# EAGLE design new 11 new (EAGLE 7.6.0)
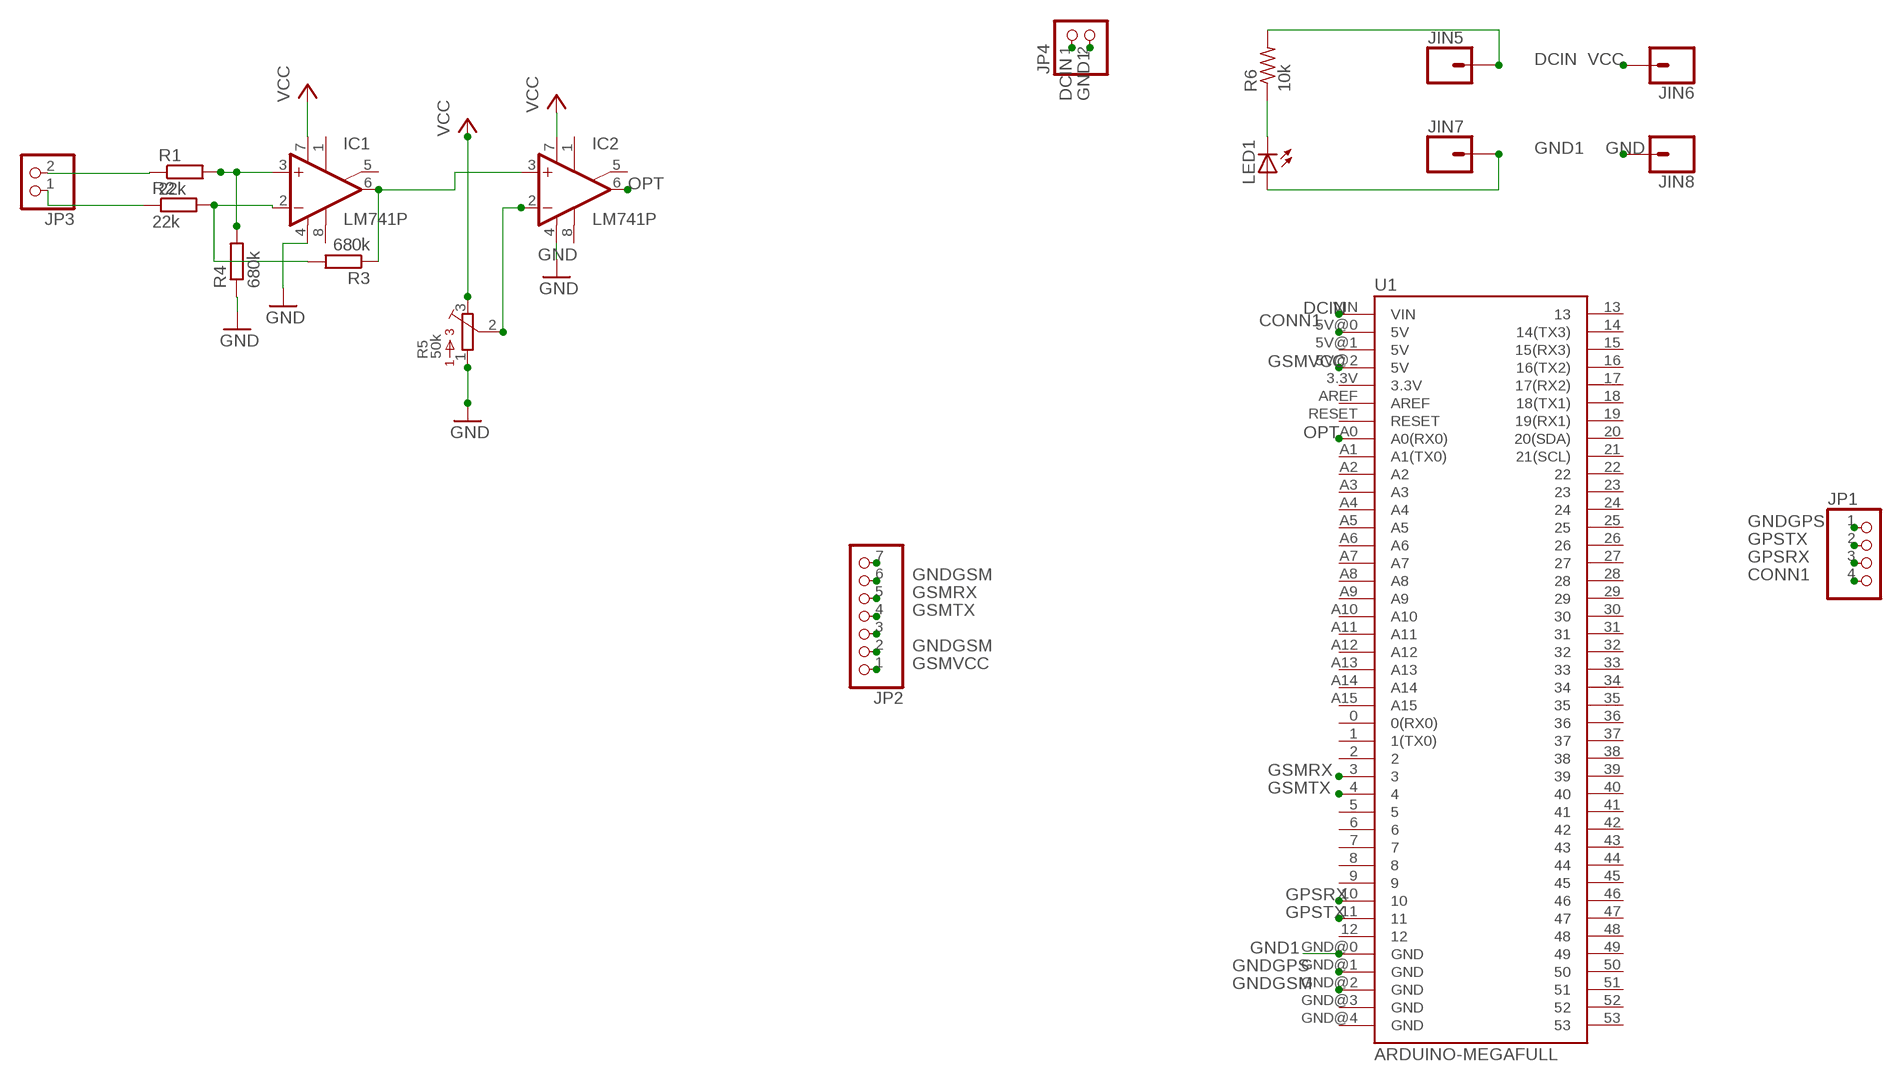
[diagram p0: schematic, sheet 1]

## Parts
IC1  LM741P  [DIL08]
IC2  LM741P  [DIL08]
JIN5  CONN_01  [1X01]
JIN6  CONN_01  [1X01]
JIN7  CONN_01  [1X01]
JIN8  CONN_01  [1X01]
JP1  PINHD-1X4  [1X04]
JP2  PINHD-1X7  [1X07]
JP3  PINHD-1X2  [1X02]
JP4  PINHD-1X2  [1X02]
LED1  LEDSQR2X5  [LED2X5]
R1  22k  R-EU_0204/7  [0204/7]
R2  22k  R-EU_0204/7  [0204/7]
R3  680k  R-EU_0204/7  [0204/7]
R4  680k  R-EU_0204/7  [0204/7]
R5  50k  3362H  [3362H]
R6  10k  R-US_0204/5  [0204/5]
U1  ARDUINO-MEGAFULL  [ARDUINO_MEGA]

## Nets
CONN1: JP1.4 U1.5V@0(5V)
DCIN: JIN5.1 JP4.1 R6.2 U1.VIN
GND: IC1.4(V-) IC2.4(V-) JIN8.1 R4.1 R5.1
GND1: JIN7.1 JP4.2 LED1.A U1.GND@0(GND)
GNDGPS: JP1.1 U1.GND@1(GND)
GNDGSM: JP2.2 JP2.6 U1.GND@2(GND)
GPSRX: JP1.3 U1.10
GPSTX: JP1.2 U1.11
GSMRX: JP2.5 U1.3
GSMTX: JP2.4 U1.4
GSMVCC: JP2.1 U1.5V@2(5V)
N$1: IC1.6(OUT) IC2.3(+IN) R3.1
N$2: IC1.2(-IN) R2.2 R3.2
N$3: JP3.1 R2.1
N$4: LED1.K(C) R6.1
N$5: JP3.2 R1.1
N$8: JP2.3
N$9: IC2.2(-IN) R5.2
N$11: IC1.3(+IN) R1.2 R4.2
N$13: JP2.7
OPT: IC2.6(OUT) U1.A0(A0(RX0))
VCC: IC1.7(V+) IC2.7(V+) JIN6.1 R5.3
Unconnected: IC1.1(ON1) IC1.5(ON2) IC1.8(OPT) IC2.1(ON1) IC2.5(ON2) IC2.8(OPT) U1.0(0(RX0)) U1.1(1(TX0)) U1.2 U1.3.3V U1.5 U1.5V@1(5V) U1.6 U1.7 U1.8 U1.9 U1.12 U1.13 U1.14(14(TX3)) U1.15(15(RX3)) U1.16(16(TX2)) U1.17(17(RX2)) U1.18(18(TX1)) U1.19(19(RX1)) U1.20(20(SDA)) U1.21(21(SCL)) U1.22 U1.23 U1.24 U1.25 U1.26 U1.27 U1.28 U1.29 U1.30 U1.31 U1.32 U1.33 U1.34 U1.35 U1.36 U1.37 U1.38 U1.39 U1.40 U1.41 U1.42 U1.43 U1.44 U1.45 U1.46 U1.47 U1.48 U1.49 U1.50 U1.51 U1.52 U1.53 U1.A1(A1(TX0)) U1.A2 U1.A3 U1.A4 U1.A5 U1.A6 U1.A7 U1.A8 U1.A9 U1.A10 U1.A11 U1.A12 U1.A13 U1.A14 U1.A15 U1.AREF U1.GND@3(GND) U1.GND@4(GND) U1.RESET

## Library data of the parts
IC1 IC2 = linear:*741: OP AMP
JIN5-JIN8 = SparkFun-Connectors:CONN_01: Single connection point. Often used as Generic Header-pin footprint for 0.1 inch spaced/style header connections On any of the 0.1 inch spaced packages, you can populate with these: Break Away Headers - Straight <https://www.sparkfun.com/products/116> (PRT-00116) Break Away Male Headers - Right Angle <https://www.sparkfun.com/products/553> (PRT-00553) Female Headers <https://www.sparkfun.com/products/115> (PRT-00115) Break Away Headers - Machine Pin <https://www.sparkfun.com/products/117> (PRT-00117) Break Away Female Headers - Swiss Machine Pin <https://www.sparkfun.com/products/743> (PRT-00743) This device is also useful as a general connection point to wire up your design to another part of your project. Our various solder wires solder well into these plated through hole pads. Hook-Up Wire - Assortment (Stranded, 22 AWG) <https://www.sparkfun.com/products/11375> (PRT-11375) Hook-Up Wire - Assortment (Solid Core, 22 AWG) <https://www.sparkfun.com/products/11367> (PRT-11367) View the entire wire category on our website here <https://www.sparkfun.com/categories/141> Special notes: SMTSO-256-ET is a "flush mount" nut for a 4-40 screw. We mostly use this on specialty testbeds; it is a nice way to connect hardware to your PCB at an adjustable hieght. Also note, the SNAP packages are for using a snappable style connector. We sell a baggie of snaps and they are also used on two LilyPad designs: Snap Assortment - 30 pack (male and female) <https://www.sparkfun.com/products/11347> (DEV-11347) LilyPad Arduino SimpleSnap <https://www.sparkfun.com/products/10941> (DEV-10941) LilyPad SimpleSnap Protoboard <https://www.sparkfun.com/products/10940> (DEV-10940)
JP1 = pinhead:PINHD-1X4: PIN HEADER
JP2 = pinhead:PINHD-1X7: PIN HEADER
JP3 JP4 = pinhead:PINHD-1X2: PIN HEADER
LED1 = adafruit:LED: LED OSRAM: - CHIPLED LG R971, LG N971, LY N971, LG Q971, LY Q971, LO R971, LY R971 LH N974, LH R974 LS Q976, LO Q976, LY Q976 LO Q996 - Hyper CHIPLED LW Q18S LB Q993, LB Q99A, LB R99A - SideLED LS A670, LO A670, LY A670, LG A670, LP A670 LB A673, LV A673, LT A673, LW A673 LH A674 LY A675 LS A676, LA A676, LO A676, LY A676, LW A676 LS A679, LY A679, LG A679 - Hyper Micro SIDELED® LS Y876, LA Y876, LO Y876, LY Y876 LT Y87S - SmartLED LW L88C, LW L88S LB L89C, LB L89S, LG L890 LS L89K, LO L89K, LY L89K LS L896, LA L896, LO L896, LY L896 - TOPLED LS T670, LO T670, LY T670, LG T670, LP T670 LSG T670, LSP T670, LSY T670, LOP T670, LYG T670 LG T671, LOG T671, LSG T671 LB T673, LV T673, LT T673, LW T673 LH T674 LS T676, LA T676, LO T676, LY T676, LB T676, LH T676, LSB T676, LW T676 LB T67C, LV T67C, LT T67C, LS T67K, LO T67K, LY T67K, LW E67C LS E67B, LA E67B, LO E67B, LY E67B, LB E67C, LV E67C, LT E67C LW T67C LS T679, LY T679, LG T679 LS T770, LO T770, LY T770, LG T770, LP T770 LB T773, LV T773, LT T773, LW T773 LH T774 LS E675, LA E675, LY E675, LS T675 LS T776, LA T776, LO T776, LY T776, LB T776 LHGB T686 LT T68C, LB T68C - Hyper Mini TOPLED® LB M676 - Mini TOPLED Santana® LG M470 LS M47K, LO M47K, LY M47K Source: http://www.osram.convergy.de/
R1-R4 = rcl:R-EU_: RESISTOR, European symbol; SPICEPREFIX: R
R5 = bourns:3362: 3362 Series 1/4" Square Trimmer
R6 = adafruit:R-US_: RESISTOR, American symbol
U1 = SparkFun-Boards:ARDUINO-MEGA: Arduino Mega board footprint

## Net classes
0 default: width 0.305 mm, drill 0.508 mm, clearance 0.254 mm

## Board
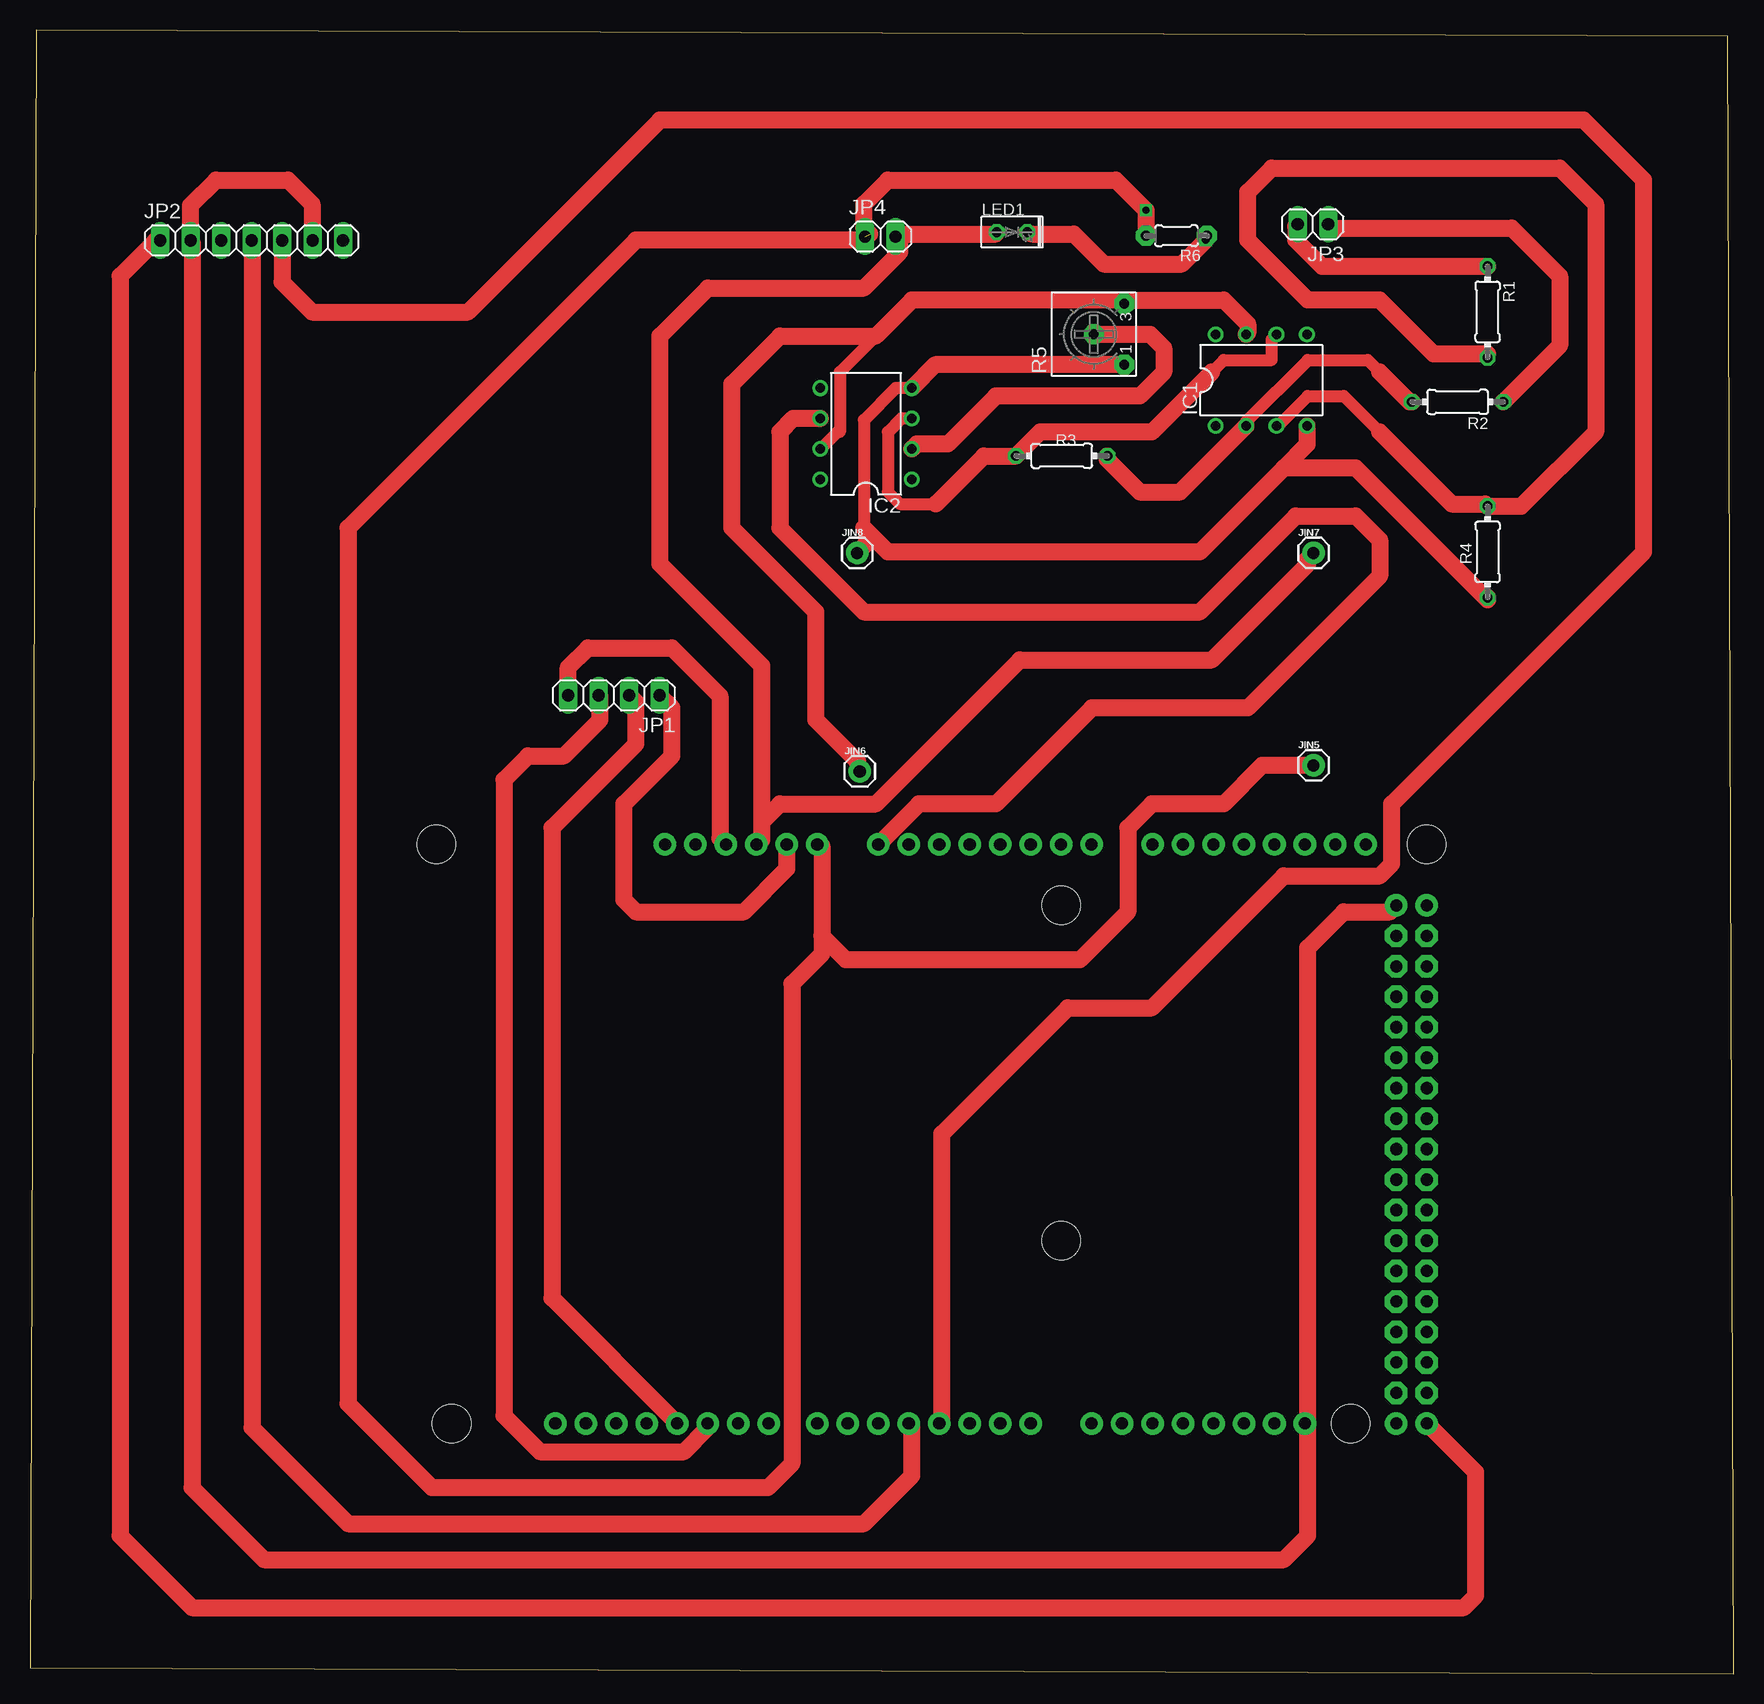
[diagram p1: board, top side]
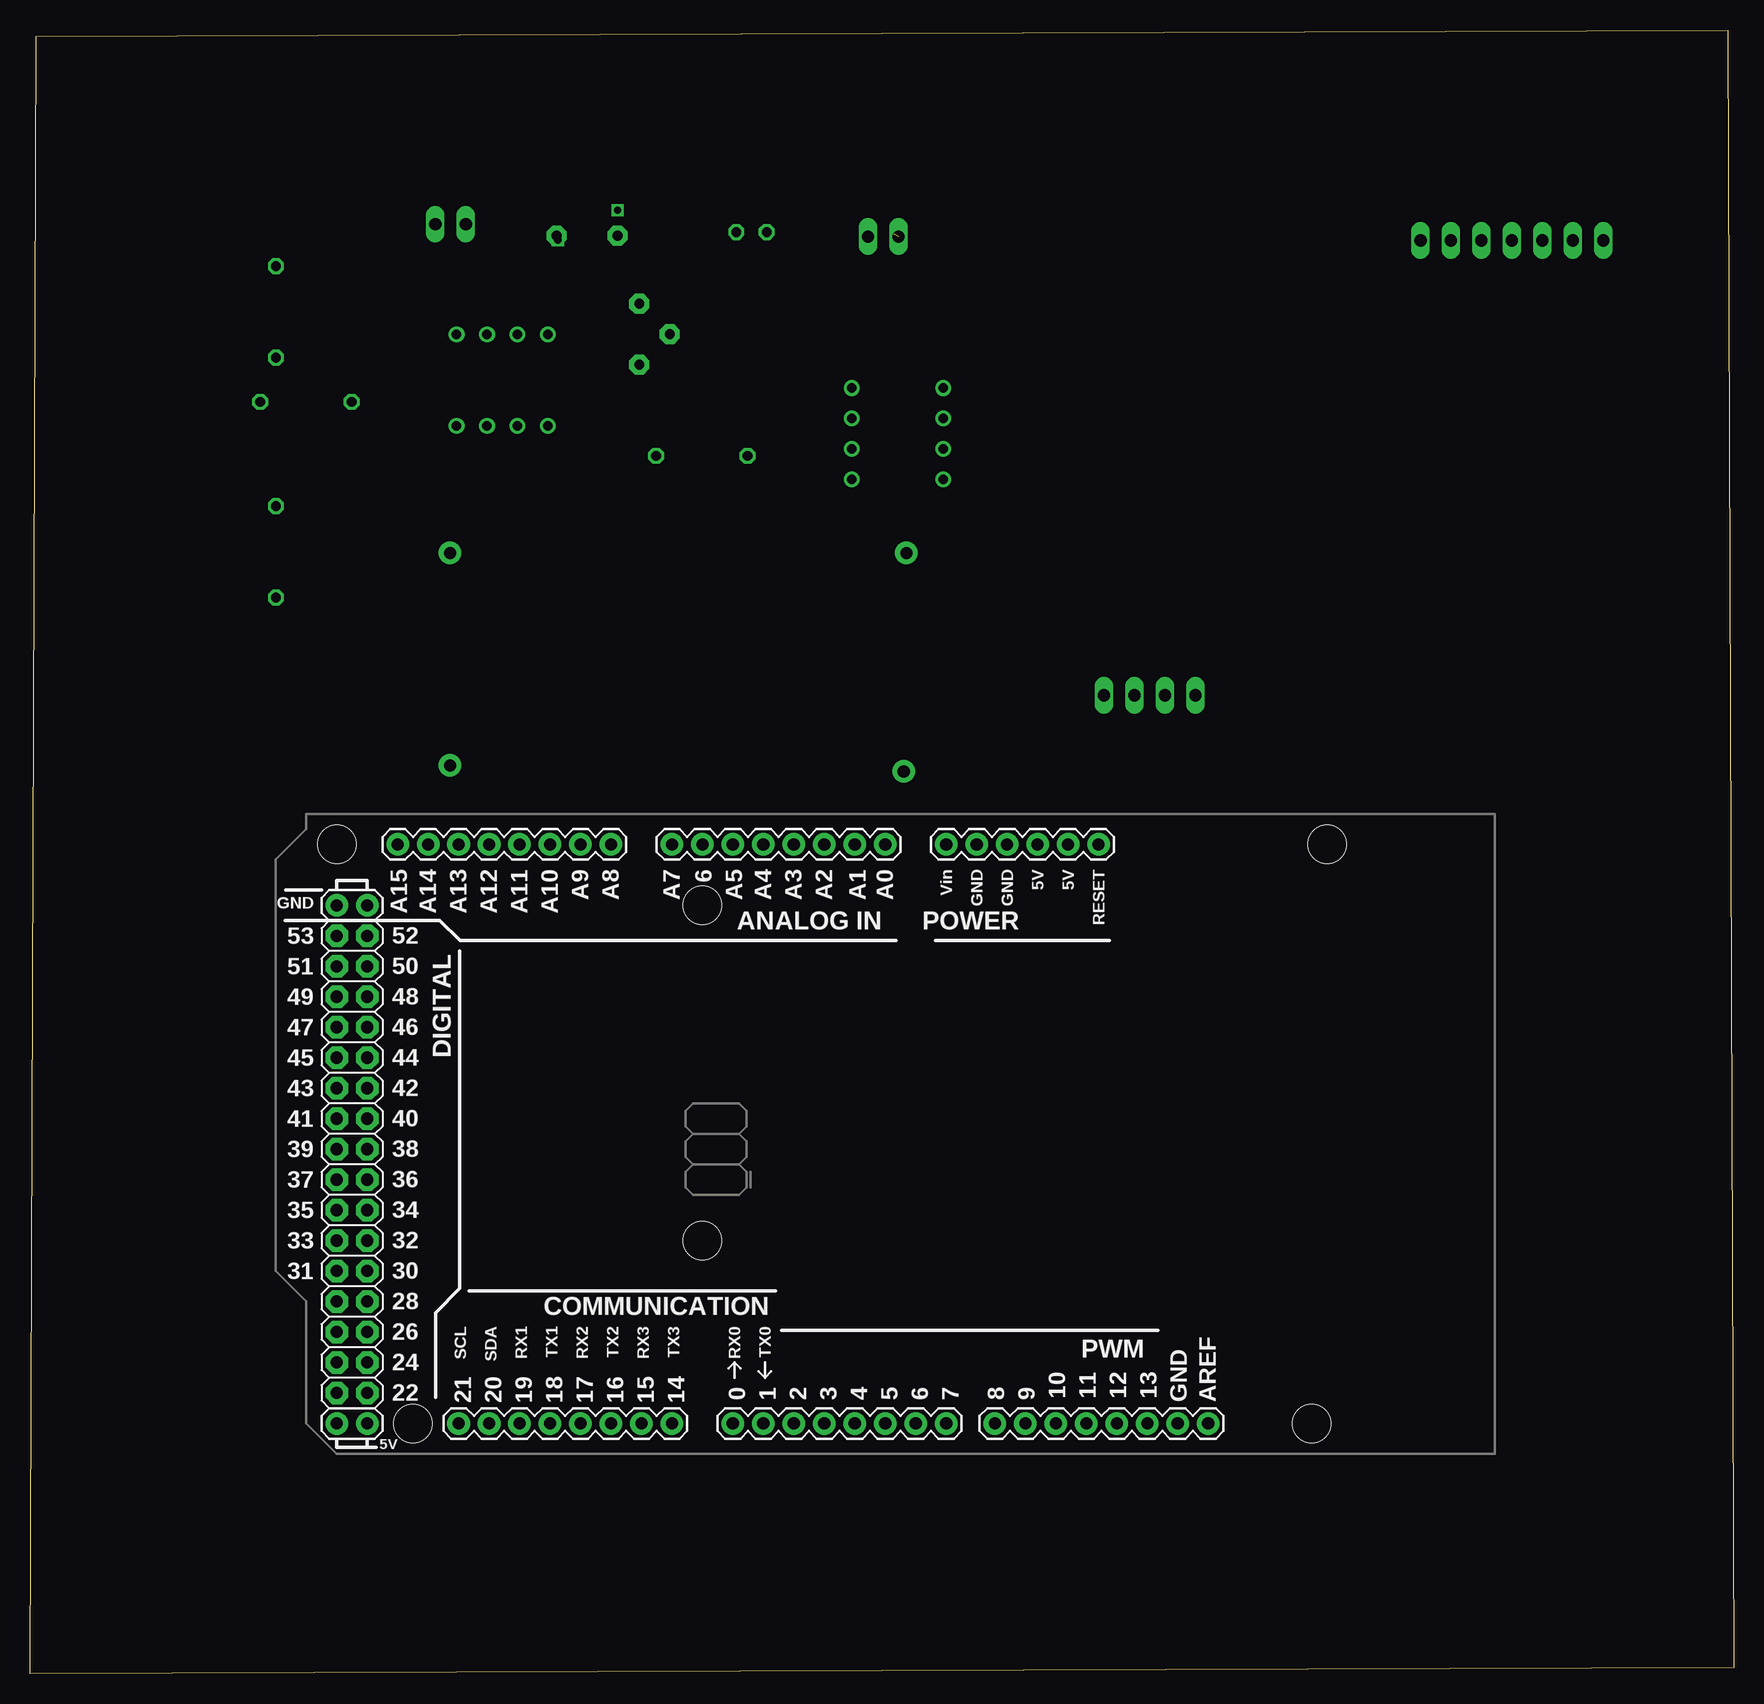
[diagram p2: board, bottom side, seen from below]

Size 142 x 137 mm. Coordinates in mm from the lower left corner, seen from the top.
Outline: 0,0.5 142,0 141.5,136.5 0.5,137 0,0.5
Copper layers (1*16): Top 0.035mm / dielectric 1.5mm / Bottom 0.035mm
Design rules "default *": minimum track width 0.7mm, minimum drill 24mil, track to track 0.7mm, track to pad 8mil, pad to pad 8mil, via to via 8mil, smd to smd 8mil, copper to edge 40mil, drill to drill 8mil, minimum pad ring 10mil, minimum via ring 8mil, stop-mask expansion 4mil, vias tented up to drill 0mil, thermal gap 10mil

### Footprints (pad centres in the part's own frame; a part is rotated, then mirrored left to right if it is on the bottom)
DIL08 = drill 0.813 pad 1.27: 1 -3.81,-3.81; 2 -1.27,-3.81; 3 1.27,-3.81; 4 3.81,-3.81; 5 3.81,3.81; 6 1.27,3.81; 7 -1.27,3.81; 8 -3.81,3.81
1X01 = drill 1.016 pad 1.88: 1 0,0
1X04 = drill 1.016 long: 1 -3.81,0; 2 -1.27,0; 3 1.27,0; 4 3.81,0
1X07 = drill 1.016 long: 1 -7.62,0; 2 -5.08,0; 3 -2.54,0; 4 0,0; 5 2.54,0; 6 5.08,0; 7 7.62,0
1X02 = drill 1.016 long: 1 -1.27,0; 2 1.27,0
LED2X5 = drill 0.813 octagon: A -1.27,0; K 1.27,0
0204/7 = drill 0.813 octagon: 1 -3.81,0; 2 3.81,0
3362H = drill 0.813 pad 1.676 octagon: 1 -2.54,-3.175; 2 0,-0.635; 3 2.54,-3.175
0204/5 = drill 0.813 pad 1.676 octagon: 1 -2.54,0; 2 2.54,0
ARDUINO_MEGA = drill 1.016 pad 1.88: 0 63.5,50.8; 1 60.96,50.8; 2 58.42,50.8; 3 55.88,50.8; 3.3V 35.56,2.54; 4 53.34,50.8; 5 50.8,50.8; 5V@0 38.1,2.54; 5V@1 93.98,50.8; 5V@2 96.52,50.8; 6 48.26,50.8; 7 45.72,50.8; 8 41.656,50.8; 9 39.116,50.8; 10 36.576,50.8; 11 34.036,50.8; 12 31.496,50.8; 13 28.956,50.8; 14 68.58,50.8; 15 71.12,50.8; 16 73.66,50.8; 17 76.2,50.8; 18 78.74,50.8; 19 81.28,50.8; 20 83.82,50.8; 21 86.36,50.8; A0 50.8,2.54; A1 53.34,2.54; A2 55.88,2.54; A3 58.42,2.54; A4 60.96,2.54; A5 63.5,2.54; A6 66.04,2.54; A7 68.58,2.54; A8 73.66,2.54; A9 76.2,2.54; A10 78.74,2.54; A11 81.28,2.54; A12 83.82,2.54; A13 86.36,2.54; A14 88.9,2.54; A15 91.44,2.54; AREF 23.876,50.8; GND@0 40.64,2.54; GND@1 43.18,2.54; GND@2 93.98,7.62; GND@3 96.52,7.62; GND@4 26.416,50.8; RESET 33.02,2.54; VIN 45.72,2.54 | drill 1.016 pad 1.88 octagon: 22 93.98,48.26; 23 96.52,48.26; 24 93.98,45.72; 25 96.52,45.72; 26 93.98,43.18; 27 96.52,43.18; 28 93.98,40.64; 29 96.52,40.64; 30 93.98,38.1; 31 96.52,38.1; 32 93.98,35.56; 33 96.52,35.56; 34 93.98,33.02; 35 96.52,33.02; 36 93.98,30.48; 37 96.52,30.48; 38 93.98,27.94; 39 96.52,27.94; 40 93.98,25.4; 41 96.52,25.4; 42 93.98,22.86; 43 96.52,22.86; 44 93.98,20.32; 45 96.52,20.32; 46 93.98,17.78; 47 96.52,17.78; 48 93.98,15.24; 49 96.52,15.24; 50 93.98,12.7; 51 96.52,12.7; 52 93.98,10.16; 53 96.52,10.16 | hole 3.2: 15.24,50.8; 13.97,2.54; 66.04,35.56; 66.04,7.62; 90.17,50.8; 96.52,2.54

### Placement (x,y rotation side)
IC1  102.64,107.81 0 top
IC2  69.69,103.35 90 top
JIN5  106.99,75.7 0 top
JIN6  69.17,75.2 0 top
JIN7  106.99,93.4 0 top
JIN8  68.94,93.4 0 top
JP1  48.67,81.54 180 top
JP2  18.47,119.46 0 top
JP3  106.94,120.81 180 top
JP4  70.88,119.78 0 top
LED1  81.86,120.15 0 top
R1  121.5,113.5 270 top
R2  119,106 180 top
R3  86,101.5 0 top
R4  121.5,93.5 90 top
R5  88.04,111.64 90 top
R6  95.57,119.85 180 top
U1  19.91,71.65 180 bottom

### Tracks (layer width: path | path; a pad name or v marks a point on that pad's centre or on a via)
CONN1
  Top 0.7: 58.5,69.5 U1.5V@0
  Top 1.4: U1.5V@0 57.5,69.62 57.5,81.5 53.5,85.5 46.5,85.5 44.86,83.86 JP1.4
DCIN  (via drill 0.6)  (1 unrouted)
  Top 0.7: 93,120 R6.2 | 66,69 U1.VIN
  Top 1.4: JIN5.1 102.7,75.7 99.5,72.5 93.5,72.5 91.5,70.5 91.5,63.5 87.5,59.5 68,59.5 66,61.5 | 70,120 69.5,120.5 69.5,122.5 71.5,124.5 90.5,124.5 v93.03,121.97 R6.2 | JP4.1 69.33,119.5 50.5,119.5 26.5,95.5 26.5,22.5 33.5,15.5 61.5,15.5 63.5,17.5 63.5,57.5 66,60 66,61.5 | 66,69 66,61.5
GND
  Top 1: IC2.4 72.16,107.16 69.5,104.5 69.5,95.5 69.5,93.96
  Top 1.4: R5.1 75.44,109.1 IC2.4 | IC1.4 106.45,102.45 104.5,100.5 | 104.5,100.5 110.5,100.5 121.5,89.5 R4.1 | 104.5,100.5 97.5,93.5 71.5,93.5 69.5,95.5 | 69.5,93.96 JIN8.1
GND1
  Top 0.7: 80.5,120 LED1.A | 72.5,120 JP4.2 72.5,119.5 | 61,69.5 U1.GND@0 | 106.5,93 JIN7.1
  Top 1.4: 72.5,120 80.5,120 | 61,71 61,84 52.5,92.5 52.5,111.5 56.5,115.5 69.5,115.5 72.5,118.5 72.5,119.43 JP4.2 72.22,119.78 | 61,69.5 61,71 | 61,71 62.5,72.5 70.5,72.5 82.5,84.5 98.5,84.5 106.5,92.5 106.5,92.91 JIN7.1
GNDGPS
  Top 0.7: 63,69 U1.GND@1
  Top 1.4: U1.GND@1 63.09,67.09 59.5,63.5 50.5,63.5 49.5,64.5 49.5,72.5 53.5,76.5 53.5,80.52 JP1.1
GNDGSM
  Top 1.4: JP2.6 23.5,119.51 23.5,122.5 21.5,124.5 15.5,124.5 13.39,122.39 JP2.2 13.5,119.35 13.5,15.5 19.5,9.5 104.5,9.5 106.5,11.5 106.5,60.5 109.5,63.5 113.36,63.5 U1.GND@2
GPSRX
  Top 1.4: U1.10 56.49,20.49 54.5,18.5 42.5,18.5 39.5,21.5 39.5,74.5 41.5,76.5 44.5,76.5 47.5,79.5 47.5,81.44 JP1.3
GPSTX
  Top 1.4: U1.11 43.5,31.3 43.5,70.5 50.5,77.5 50.5,80.98 JP1.2
GSMRX
  Top 0.7: 76,21 U1.3
  Top 1.4: 76,21 76,45 86.5,55.5 93.5,55.5 104.5,66.5 112.5,66.5 113.5,67.5 113.5,72.5 134.5,93.5 134.5,124.5 129.5,129.5 52.5,129.5 36.5,113.5 23.5,113.5 21.01,115.99 JP2.5
GSMTX
  Top 0.7: 73,20.5 U1.4
  Top 1: 73.5,20.6 U1.4
  Top 1.4: 73.5,20.6 73.5,16.5 69.5,12.5 26.5,12.5 18.5,20.5 18.5,119.43 JP2.4
GSMVCC
  Top 0.7: 116,20.5 U1.5V@2
  Top 1.4: U1.5V@2 120.5,16.78 120.5,6.5 119.5,5.5 13.5,5.5 7.5,11.5 7.5,116.5 10.5,119.5 10.81,119.5 JP2.1
N$1
  Top 1: IC2.3 72.62,104.62 71.5,103.5 71.5,98.5 72.5,97.5 75.5,97.5 | 98.5,108.5 99.5,109.5 103.5,109.5 103.5,111.21 IC1.6
  Top 1.4: 98.5,108.5 93.5,103.5 84.19,103.5 R3.1 79.5,101.5 75.5,97.5
N$2
  Top 1: IC1.2 101.37,104.37 106.5,109.5 111.5,109.5 112.5,108.5
  Top 1.4: R2.2 115,106 112.5,108.5 | R3.2 89.81,101.19 92.5,98.5 95.87,98.5 IC1.2
N$3
  Top 1.4: JP3.1 108.52,120.5 123.5,120.5 127.5,116.5 127.5,110.69 R2.1
N$4  (via drill 0.6)
  Top 0.7: 83.5,120 LED1.K | v98,119.5 R6.1
  Top 1.4: 83.5,120 87,120 89.5,117.5 96,117.5 v98,119.5
N$5
  Top 0.7: 121.5,117.5 R1.1
  Top 1.4: JP3.2 105.5,120.64 105.5,119.5 107.69,117.31 R1.1
N$9
  Top 1.4: R5.2 93.36,111.64 94.5,110.5 94.5,108.5 92.5,106.5 80.5,106.5 76.5,102.5 73.92,102.5 IC2.2
N$11
  Top 0.7: 121.5,97.5 R4.2 | 121.5,110 R1.2
  Top 1: IC1.3 104,104 106.5,106.5 109.5,106.5 112.5,103.5
  Top 1.4: 121.5,110 117,110 112.5,114.5 106.5,114.5 101.5,119.5 101.5,123.5 103.5,125.5 127.5,125.5 130.5,122.5 130.5,103.5 124.31,97.31 R4.2 121.31,97.5 118.5,97.5 112.5,103.5
OPT
  Top 1.4: IC2.6 63.62,104.62 62.5,103.5 62.5,95.5 69.5,88.5 97.5,88.5 105.5,96.5 110.5,96.5 112.5,94.5 112.5,91.5 101.5,80.5 88.5,80.5 80.5,72.5 74.1,72.5 U1.A0
VCC
  Top 0.7: 69,75.5 JIN6.1
  Top 1: 70.5,111.5 67.5,108.5 67.5,103.5 67.3,103.5 IC2.7
  Top 1.4: R5.3 91.53,114.5 | 69,75.5 69,76 65.5,79.5 65.5,88.5 58.5,95.5 58.5,107.5 62.5,111.5 70.5,111.5 73.5,114.5 91.53,114.5 | 91.53,114.5 99.5,114.5 101.5,112.5 101.5,111.75 IC1.7